# Altium schematic sheet PSoC6-Cardiac-Schematic.SchDoc
size 381 x 342 mm; SheetNumber: 1; SheetTotal: 1
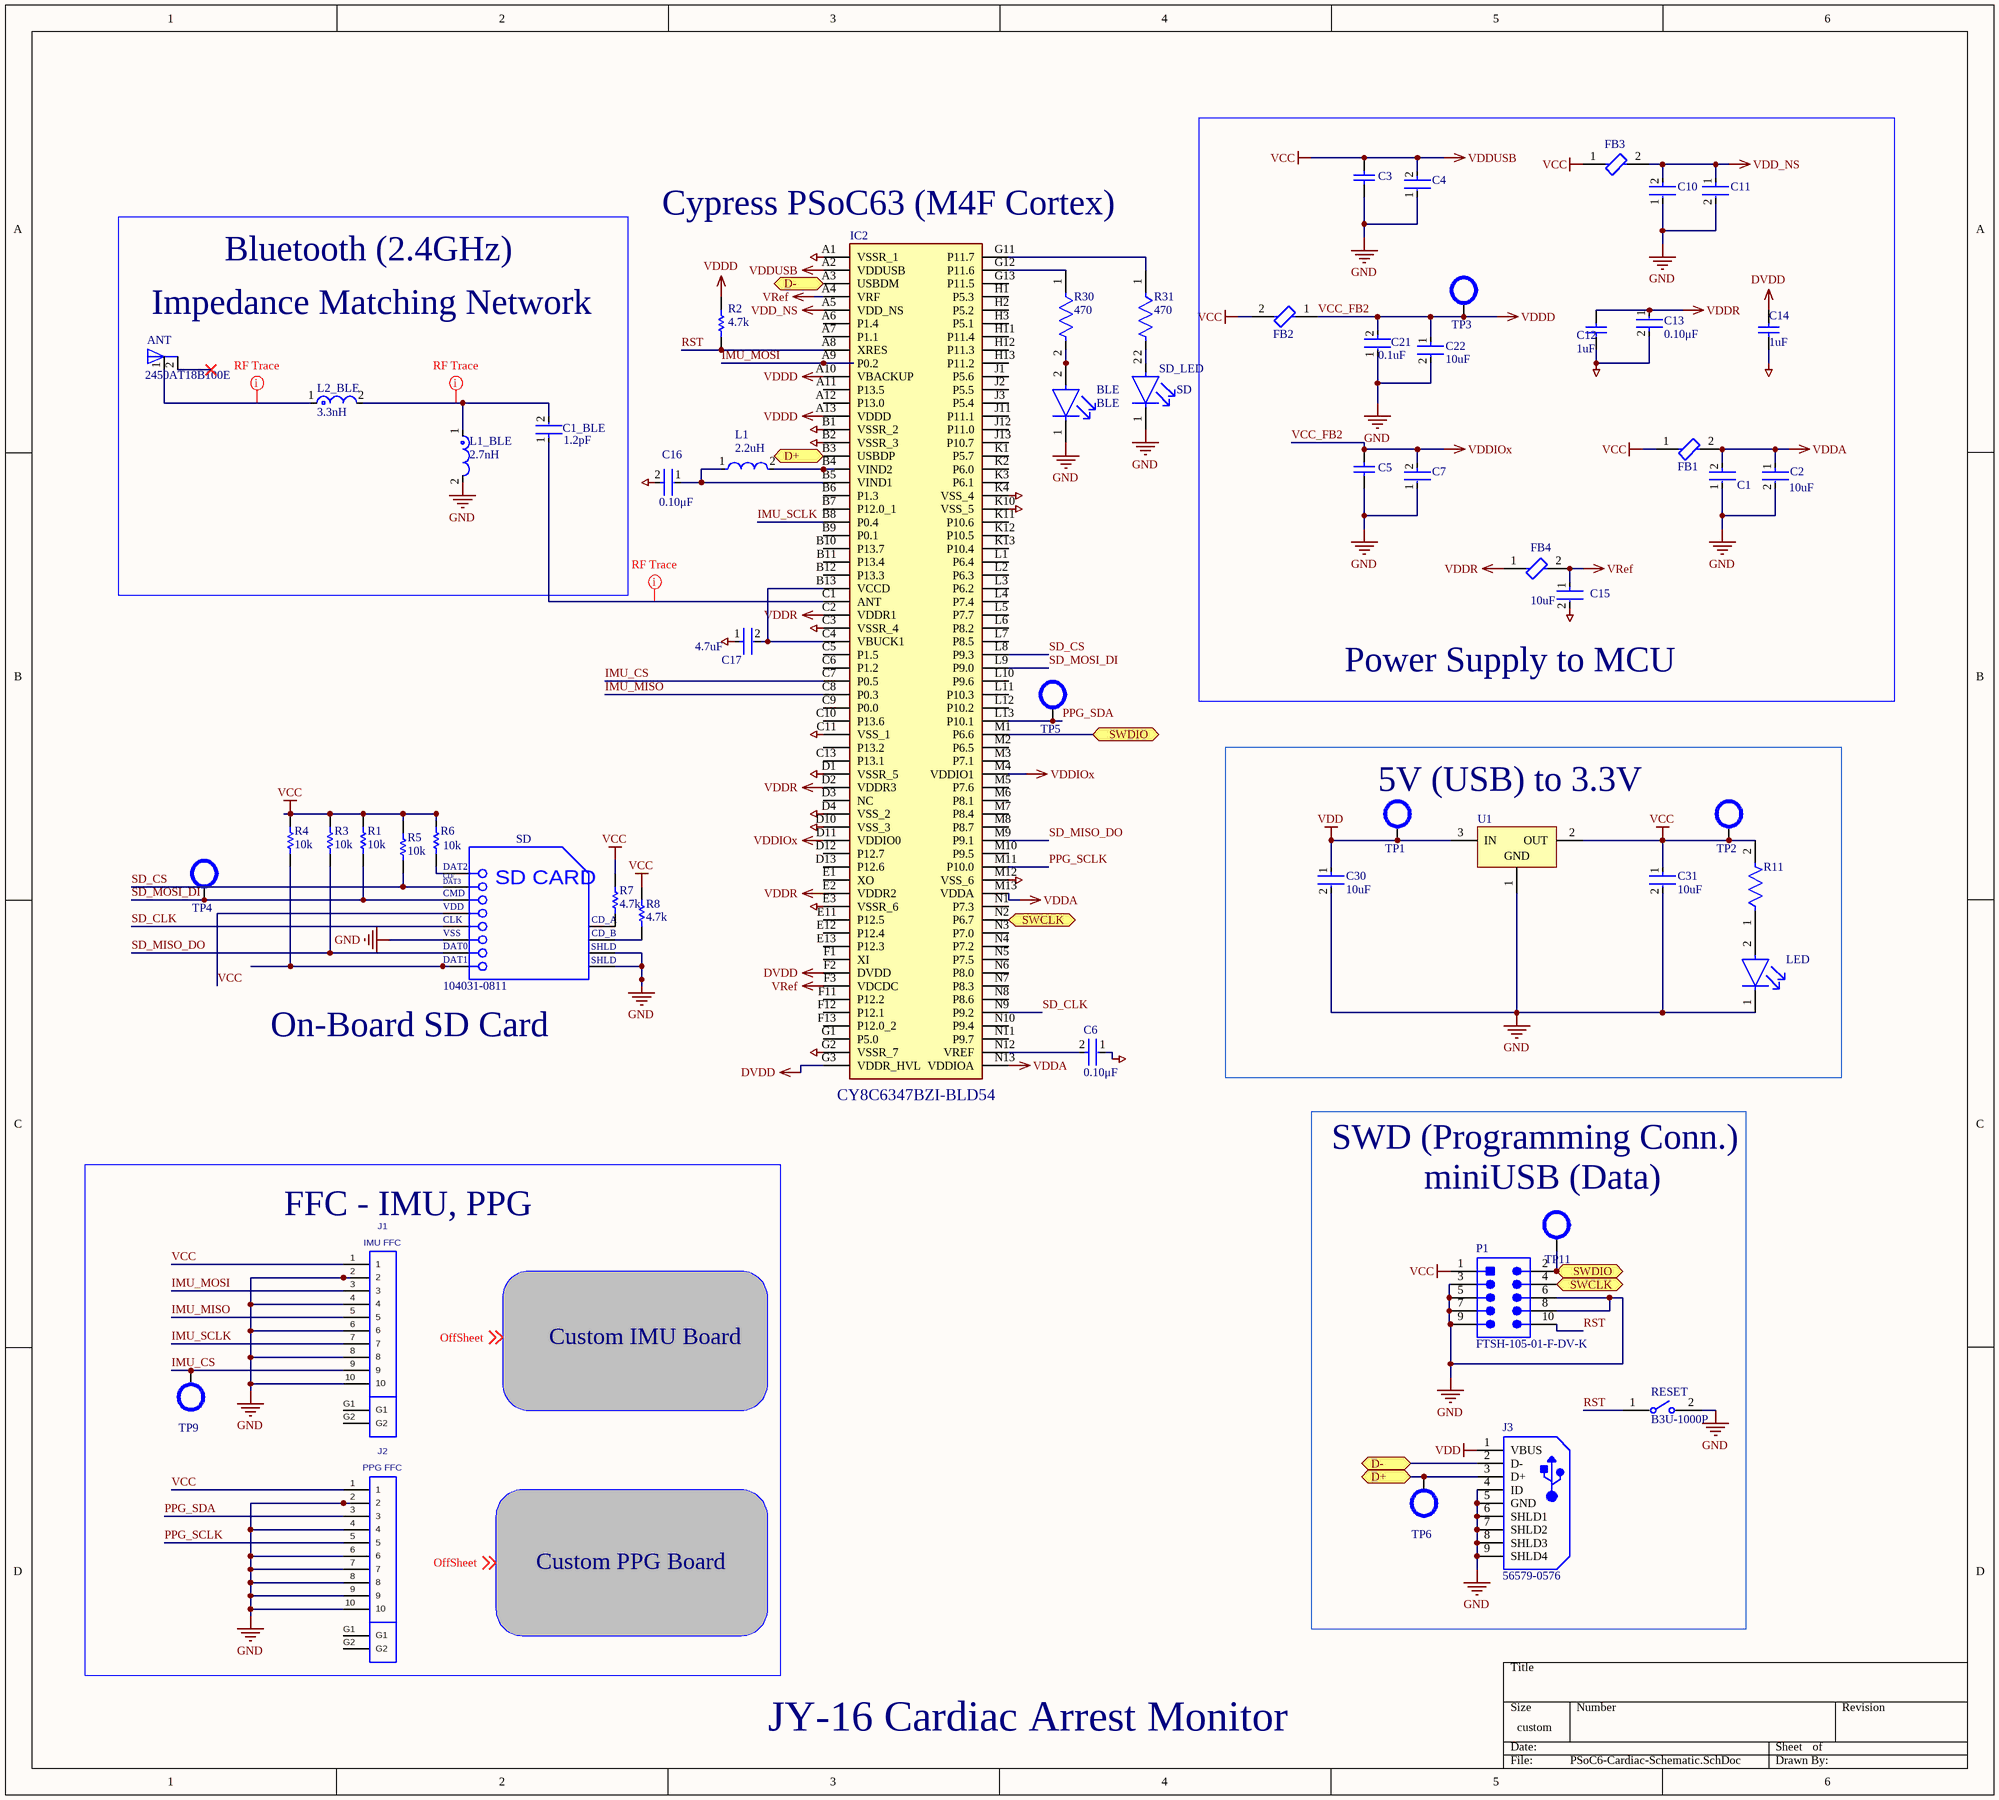
[diagram p0: PSoC6-Cardiac-Schematic.SchDoc]

## Parts
ANT  2450AT18B100E  [XDCR_2450AT18B100E]
BLE  BLE  [FP-6_541-5092_01-4-MFG]
C1  GRM155R71C104KA88D  [FP-GRM15-MFG]  (value not drawn)
C1_BLE  1.2pF  [FP-GJM155-0_05-IPC_B]
C2  10uF  [FP-GRM188-0_1-e0_2_0_55-IPC_A]
C3  GRM188R61E105KA12D  [CAPC1608X90X35LL10T15]  (value not drawn)
C4  GRM155R71C104KA88D  [FP-GRM15-MFG]  (value not drawn)
C5  GRM188R61E105KA12D  [CAPC1608X90X35LL10T15]  (value not drawn)
C6  Capacitance: 0.10μF  [FP-GRM15-MFG]  (hidden comment: GRM155R71C104KA88D)
C7  GRM155R71C104KA88D  [FP-GRM15-MFG]  (value not drawn)
C10  GRM155R71C104KA88D  [FP-GRM15-MFG]  (value not drawn)
C11  GRM188R60J106ME47D  [FP-GRM188-0_1-e0_2_0_55-IPC_A]  (value not drawn)
C12  value 1uF  [CAPC1608X90X35ML10T15]  (hidden comment: GRM188R61E105KA12D)
C13  Capacitance: 0.10μF  [FP-GRM15-MFG]  (hidden comment: GRM155R71C104KA88D)
C14  value 1uF  [CAPC1608X90X35ML10T15]  (hidden comment: GRM188R61E105KA12D)
C15  Capacitance: 10uF  [FP-GRM188-0_1-e0_2_0_55-IPC_A]  (hidden comment: GRM188R60J106ME47D)
C16  Capacitance: 0.10μF  [FP-GRM15-MFG]  (hidden comment: GRM155R71C104KA88D)
C17  Capacitance: 4.7uF  [FP-GRM155-0_1-IPC_B]  (hidden comment: GRM155R60J475ME47D)
C21  0.1uF  [FP-GRM15-MFG]
C22  10uF  [FP-GRM188-0_1-e0_2_0_55-IPC_A]
C30  10uF  [FP-GRM155-0_15-IPC_B]
C31  10uF  [FP-GRM155-0_15-IPC_B]
FB1  BLM18HE102SN1D  [FP-BLM18-0_15-t0_8-MFG]  (value not drawn)
FB2  BLM18HE102SN1D  [FP-BLM18-0_15-t0_8-MFG]  (value not drawn)
FB3  BLM18HE102SN1D  [FP-BLM18-0_15-t0_8-MFG]  (value not drawn)
FB4  BLM18HE102SN1D  [FP-BLM18-0_15-t0_8-MFG]  (value not drawn)
IC2  CY8C6347BZI-BLD54  [BGAS124C65P13X13_900X900X100]
J1  IMU FFC  [ZF5S-10-01-X-WT]
J2  PPG FFC  [ZF5S-10-01-X-WT]
J3  56579-0576  [MOLX-56579-0576_V]
L1  2.2uH  [FP-LQM21PH_G0-IPC_C]
L1_BLE  2.7nH  [FP-LQP03TG_02-IPC_A]
L2_BLE  3.3nH  [FP-LQG18HH_00-MFG]
LED  LTST-C190GKT  [FP-LTST-C190GKT-MFG]  (value not drawn)
P1  FTSH-105-01-F-DV-K  [SMTC-FTSH-105-01-L-DV-K_V]
R1  10k  [RESC1005X40X25LL05T10]
R2  4.7k  [RESC1005X40X25LL05T05]
R3  10k  [RESC1005X40X25LL05T10]
R4  10k  [RESC1005X40X25LL05T10]
R5  10k  [RESC1005X40X25LL05T10]
R6  10k  [RESC1005X40X25LL05T10]
R7  4.7k  [RESC1005X40X25LL05T05]
R8  4.7k  [RESC1005X40X25LL05T05]
R11  CRCW08052K00FKEA  [FP-CRCW0805-e3-IPC_B]  (value not drawn)
R30  470  [FP-CRCW0402-e3-MFG]
R31  470  [FP-CRCW0402-e3-MFG]
RESET  B3U-1000P  [FP-B3U-1000P-MFG]
SD  104031-0811  [MOLX-104031-0811_V]
SD_LED  SD  [FP-6_541-5092_01-4-MFG]
TP1  TestPoint  [TestPoint]  (value not drawn)
TP2  TestPoint  [TestPoint]  (value not drawn)
TP3  TestPoint  [TestPoint]  (value not drawn)
TP4  TestPoint  [TestPoint]  (value not drawn)
TP5  TestPoint  [TestPoint]  (value not drawn)
TP6  TestPoint  [TestPoint]  (value not drawn)
TP9  TestPoint  [TestPoint]  (value not drawn)
TP11  TestPoint  [TestPoint]  (value not drawn)
U1  ADP3338AKCZ-3.3-RL  [ADI-KC-3_L]  (value not drawn)

## Blocks framed on the sheet
Power Supply to MCU: C1-C5 C7 C10-C15 C21 C22 FB1-FB4 TP3
5V (USB) to 3.3V: C30 C31 LED R11 TP1 TP2 U1
FFC - IMU, PPG: J1 J2 TP9

## Ports
D+ (bidir), D- (bidir), SWCLK (bidir), SWDIO (bidir)

## Nets
DVDD: C14.1 IC2.F2(DVDD) IC2.G3(VDDR_HVL)
GND: BLE.1(C) C1.1 C2.2 C3.1 C4.1 C5.1 C6.1 C7.1 C10.1 C11.2 C12.2 C13.2 C14.2 C15.2 C16.2 C17.1 C21.1 C22.2 C30.2 C31.2 IC2.A1(VSSR_1) IC2.B1(VSSR_2) IC2.B2(VSSR_3) IC2.C3(VSSR_4) IC2.C11(VSS_1) IC2.D1(VSSR_5) IC2.D4(VSS_2) IC2.D10(VSS_3) IC2.E3(VSSR_6) IC2.G2(VSSR_7) IC2.K4(VSS_4) IC2.K10(VSS_5) IC2.M12(VSS_6) J1.2 J1.4 J1.6 J1.8 J1.10 J2.2 J2.4 J2.6 J2.7 J2.8 J2.9 J2.10 J3.4(ID) J3.5(GND) J3.6(SHLD1) J3.7(SHLD2) J3.8(SHLD3) J3.9(SHLD4) L1_BLE.2 LED.1(C) P1.3 P1.5 P1.6 P1.7 P1.8 P1.9 RESET.2 SD.6(VSS2) SD.11(SHLD1) SD.12(SHLD2) SD_LED.1(C) U1.1(GND)
VCC: C3.2 C4.2 C31.1 FB1.1 FB2.2 FB3.1 IC2.A2(VDDUSB) J1.1 J2.1 P1.1 R1.2 R3.2 R4.2 R5.2 R6.2 R7.2 R8.2 R11.2 SD.4(VDD) TP2.TP?(TP) U1.2(OUT)  [also labelled VDDUSB]
VCC_FB2: C5.2 C7.2 C21.2 C22.1 FB2.1 IC2.A10(VBACKUP) IC2.A13(VDDD) IC2.D11(VDDIO0) IC2.M4(VDDIO1) R2.2 TP3.TP?(TP)  [also labelled VDDD, VDDIOx]
VDD: C30.1 J3.1(VBUS) TP1.TP?(TP) U1.3(IN)
VDD_NS: C10.2 C11.1 FB3.2 IC2.A5(VDD_NS)
VDDA: C1.2 C2.1 FB1.2 IC2.M13(VDDA) IC2.N13(VDDIOA)
VDDR: C12.1 C13.1 FB4.1 IC2.C2(VDDR1) IC2.D2(VDDR3) IC2.E2(VDDR2)
VRef: C15.1 FB4.2 IC2.A4(VRF) IC2.F3(VDCDC)
D+: IC2.B3(USBDP) J3.3(D+) TP6.TP?(TP) ; port D+
D-: IC2.A3(USBDM) J3.2(D-) ; port D-
IMU_CS: IC2.C7(P0.5) J1.9 TP9.TP?(TP)
IMU_MISO: IC2.C8(P0.3) J1.5
IMU_MOSI: IC2.A9(P0.2) J1.3
IMU_SCLK: IC2.B8(P0.4) J1.7
PPG_SCLK: IC2.M11(P10.0) J2.5
PPG_SDA: IC2.L13(P10.1) J2.3 TP5.TP?(TP)
RST: IC2.A8(XRES) P1.10 R2.1 RESET.1
SD_CLK: IC2.N9(P9.2) SD.5(CLK)
SD_CS: IC2.L8(P9.3) R5.1 SD.2(CMD)
SD_MISO_DO: IC2.M9(P9.1) R3.1 SD.7(DAT0)
SD_MOSI_DI: IC2.L9(P9.0) R1.1 SD.3(VSS1) TP4.TP?(TP)
SWCLK: IC2.N2(P6.7) P1.4 ; port SWCLK
SWDIO: IC2.M1(P6.6) P1.2 TP11.TP?(TP) ; port SWDIO
NetANT_1: ANT.1(FEED) L2_BLE.1
NetBLE_2: BLE.2(A) R30.2
NetC1_BLE_1: C1_BLE.1 IC2.C1(ANT)
NetC1_BLE_2: C1_BLE.2 L1_BLE.1 L2_BLE.2
NetC6_2: C6.2 IC2.N12(VREF)
NetC16_1: C16.1 IC2.B5(VIND1) L1.1
NetC17_2: C17.2 IC2.B13(VCCD) IC2.C4(VBUCK1)
NetIC2_B4: IC2.B4(VIND2) L1.2
NetIC2_G11: IC2.G11(P11.7) R31.1
NetIC2_G12: IC2.G12(P11.6) R30.1
NetLED_2: LED.2(A) R11.1
NetR4_1: R4.1 SD.8(DAT1)
NetR6_1: R6.1 SD.1(CD/DAT3)
NetR7_1: R7.1 SD.9(CD_A)
NetR8_1: R8.1 SD.10(CD_B)
NetR31_2: R31.2 SD_LED.2(A)

Not connected (* = marked no-connect by the designer): ANT 2(NC)*; IC2 ?1(P13.2) A6(P1.4) A7(P1.1) A11(P13.5) A12(P13.0) B6(P1.3) B7(P12.0_1) B9(P0.1) B10(P13.7) B11(P13.4) B12(P13.3) C5(P1.5) C6(P1.2) C9(P0.0) C10(P13.6) C13(P13.1) D3(NC) D12(P12.7) D13(P12.6) E1(XO) E11(P12.5) E12(P12.4) E13(P12.3) F1(XI) F11(P12.2) F12(P12.1) F13(P12.0_2) G1(P5.0) G13(P11.5) H1(P5.3) H2(P5.2) H3(P5.1) H11(P11.4) H12(P11.3) H13(P11.2) J1(P5.6) J2(P5.5) J3(P5.4) J11(P11.1) J12(P11.0) J13(P10.7) K1(P5.7) K2(P6.0) K3(P6.1) K11(P10.6) K12(P10.5) K13(P10.4) L1(P6.4) L2(P6.3) L3(P6.2) L4(P7.4) L5(P7.7) L6(P8.2) L7(P8.5) L10(P9.6) L11(P10.3) L12(P10.2) M2(P6.5) M3(P7.1) M5(P7.6) M6(P8.1) M7(P8.4) M8(P8.7) M10(P9.5) N1(P7.3) N3(P7.0) N4(P7.2) N5(P7.5) N6(P8.0) N7(P8.3) N8(P8.6) N10(P9.4) N11(P9.7); J1 G1 G2; J2 G1 G2

## Layout directives
mark named RF Trace: NetANT_1, NetC1_BLE_1, NetC1_BLE_2

## Notes on the sheet
- (near IC2) Cypress PSoC63 (M4F Cortex)
- Bluetooth (2.4GHz)
- (near ANT) Impedance Matching Network
- (near SD) On-Board SD Card
- SWD (Programming Conn.)
- (near TP11) miniUSB (Data)
- Custom IMU Board
- Custom PPG Board
- JY-16 Cardiac Arrest Monitor
- Labels drawn without touching a wire or pin: OffSheet
- (in symbol CMP-2000-05825-1) DAT2; CD/; DAT3; SD CARD; VSS; SHLD

## Library data of the parts
ANT = 2450AT18B100E: 2.4GHz - Chip RF Antenna 2.4GHz ~ 2.5GHz 0.5dBi Solder Surface Mount; MF: Johanson Technology; Price: None; Package: None; Purchase-URL: https://pricing.snapeda.com/search/part/2450AT18B100E/?ref=eda; MP: 2450AT18B100E; Availability: In Stock; SnapEDA_Link: https://www.snapeda.com/parts/2450AT18B100E/Johanson+Technology+Inc./view-part/?ref=snap; Check_prices: https://www.snapeda.com/parts/2450AT18B100E/Johanson+Technology+Inc./view-part/?ref=eda; Value: *
BLE = CMP-02520-000011-1: LED GREEN 0603 SMD; Manufacturer Part Number: VLMG1300-GS08; Manufacturer: Vishay; Peak Emmision Wavelength: 574nm; Power Dissipation: 75mW; Viewing Angle: 130°; Reverse Voltage: 5V; Led Orientation: Top View; Forward Current: 20mA; Forward Voltage: 2V; Luminous Intensity: 35mcd; Wavelength: 571nm; Height: 1mm; Mouser Description: LED; SMD; 0603; yellow green; 18-35mcd; 1.6x0.8x0.8mm; 130°; 2÷2.4V; Category: Diode; Temperature: -35°C to +85°C; Ambient Temperature Range Low: -35°C; Package: 6.541-5092.01-4; Colour: Yellow Green; RoHS: TRUE; Device Class L2: LEDs; ComponentLink2Description: Datasheet; Device Class L3: unset; Octopart: https://octopart.com/vlmg1300-gs08-vishay-21709199; Device Class L1: Optoelectronics; Temperature Range Low: -35°C; Automotive: No; Lead Free: Yes; Ambient Temperature Range High: +85°C; Digikey Description: LED GREEN 0603 SMD; Temperature Range High: +85°C; ComponentLink2URL: http://www.vishay.com/docs/82437/vlmo1300.pdf
C1 C4 C7 C10 = CMP-2100-03641-2: CAP CER 0.1UF 16V X7R 0402; Manufacturer: Murata; Standoff Height: 0mm; Tolerance: 10%; Voltage Rating: 16Vdc; Material: Ceramic; Capacitance: 0.10μF; Value: 0.10μF; RoHS: TRUE; Manufacturer Part Number: GRM155R71C104KA88D; Temperature Characteristic: X7R; Octopart: https://octopart.com/grm155r71c104ka88d-murata-196880; Digikey Description: CAP CER 0.1UF 16V X7R 0402; Device Class L3: Ceramic Capacitors; Height: 0.55mm; ComponentLink2Description: Datasheet; Temperature Range Low: -55°C; Ipc Land Pattern Name: CAPC10050X219; ComponentLink2URL: https://search.murata.co.jp/Ceramy/image/img/A01X/G101/ENG/GRM155R71H471KA01-01A.pdf; Device Class L1: Passive Components; Lead Free: yes; Category: Cap; Package: GRM15; Temperature: -55°C to +125°C; Device Class L2: Capacitors; Temperature Range High: +125°C; Mouser Description: 0402 0.1 uF 16V ±10 % Tolerance X7R SMT Multilayer Ceramic Capacitor
C1_BLE = CMP-2008-03813-2: Multi-Layer Ceramic Capacitor 1.2pF C0G  ±0.1pF 0402 Paper T/R; Voltage Rating (DC): 50V; Temperature Coefficient: 30ppm/°C; Case Code (Metric): 1005; Lead Free: Lead Free; Packaging: Tape and Reel; Radiation Hardening: No; Dielectric: C0G; Case Code (Imperial): 0402; Weight: 2.3E-05oz; Width: 0.5mm; Case/Package: 0402; Length: 1mm; Voltage Rating: 50V; Number of Pins: 2; Depth: 0.5mm; Thickness: 0.022inch; Voltage: 50V; Package Quantity: 10000; Max Operating Temperature: 125°C; Height: 0.5mm; REACH SVHC: No SVHC; Capacitance: 1.2pF; Mount: Surface Mount; Min Operating Temperature: -55°C; Termination: SMD/SMT; Lead Pitch: 0.3mm
C2 C11 C15 C22 = CMP-2006-02792-2: Chip Multilayer Ceramic Capacitors for General Purpose, 0603, 10uF, X5R, 15%, 20%, 6.3V; Tolerance: 20%; Height: 0.8mm; Lead Free: Lead Free; Material: Ceramic; Voltage: 6.3V; Voltage Rating: 6.3V; Packaging: Tape and Reel; Voltage Rating (DC): 6.3V; Width: 0.031inch; Termination: SMD/SMT; Dielectric: X5R; Package Quantity: 4000; Case/Package: 0603; Min Operating Temperature: -55°C; Length: 1.6mm; Thickness: 0.035inch; Depth: 0.8mm; Case Code (Imperial): 0603; Max Operating Temperature: 85°C; Mount: Surface Mount; REACH SVHC: No SVHC; Radiation Hardening: No; Case Code (Metric): 1608
  C2 C11 C22: Capacitance: 10uF
C3 C5 C12 C14 = CMP-2006-02459-1: Manufacturer: Murata; Part Number: GRM188R61E105KA12D
C6 C13 C16 = CMP-2100-03641-2: CAP CER 0.1UF 16V X7R 0402; Manufacturer: Murata; Standoff Height: 0mm; Tolerance: 10%; Voltage Rating: 16Vdc; Material: Ceramic; Value: 0.10μF; RoHS: TRUE; Manufacturer Part Number: GRM155R71C104KA88D; Temperature Characteristic: X7R; Octopart: https://octopart.com/grm155r71c104ka88d-murata-196880; Digikey Description: CAP CER 0.1UF 16V X7R 0402; Device Class L3: Ceramic Capacitors; Height: 0.55mm; ComponentLink2Description: Datasheet; Temperature Range Low: -55°C; Ipc Land Pattern Name: CAPC10050X219; ComponentLink2URL: https://search.murata.co.jp/Ceramy/image/img/A01X/G101/ENG/GRM155R71H471KA01-01A.pdf; Device Class L1: Passive Components; Lead Free: yes; Category: Cap; Package: GRM15; Temperature: -55°C to +125°C; Device Class L2: Capacitors; Temperature Range High: +125°C; Mouser Description: 0402 0.1 uF 16V ±10 % Tolerance X7R SMT Multilayer Ceramic Capacitor
C17 = CMP-2008-04549-2: Chip Multilayer Ceramic Capacitors for General Purpose, 0402, 4.7uF, X5R, 15%, 20%, 6.3V; Height: 0.5mm; Weight: 0.000212oz; Length: 1mm; Case Code (Metric): 1005; Packaging: Tape and Reel; Termination: SMD/SMT; Dielectric: X5R; Depth: 0.5mm; Case Code (Imperial): 0402; Min Operating Temperature: -55°C; Case/Package: 0402; Voltage: 6.3V; Width: 0.02inch; Lead Free: Lead Free; Thickness: 0.022inch; Contact Plating: Tin; REACH SVHC: No SVHC; Package Quantity: 10000; Tolerance: 20%; Voltage Rating (DC): 6.3V; Voltage Rating: 6.3V; Mount: Surface Mount; Max Operating Temperature: 85°C
C21 = CMP-2100-03641-2: CAP CER 0.1UF 16V X7R 0402; Manufacturer Part Number: GRM155R71C104KA88D; Manufacturer: Murata; Standoff Height: 0mm; Tolerance: 10%; Voltage Rating: 16Vdc; Material: Ceramic; Capacitance: 0.10μF; Value: 0.10μF; RoHS: TRUE; Temperature Characteristic: X7R; Octopart: https://octopart.com/grm155r71c104ka88d-murata-196880; Digikey Description: CAP CER 0.1UF 16V X7R 0402; Device Class L3: Ceramic Capacitors; Height: 0.55mm; ComponentLink2Description: Datasheet; Temperature Range Low: -55°C; Ipc Land Pattern Name: CAPC10050X219; ComponentLink2URL: https://search.murata.co.jp/Ceramy/image/img/A01X/G101/ENG/GRM155R71H471KA01-01A.pdf; Device Class L1: Passive Components; Lead Free: yes; Category: Cap; Package: GRM15; Temperature: -55°C to +125°C; Device Class L2: Capacitors; Temperature Range High: +125°C; Mouser Description: 0402 0.1 uF 16V ±10 % Tolerance X7R SMT Multilayer Ceramic Capacitor
C30 C31 = CMP-06035-012416-1: GRM155R60J106ME15D / Chip Multilayer Ceramic Capacitors for General Purpose, 0402, 10uF, X5R, 15%, 20%, 6.3V; Thickness: 0.026inch; Case Code (Imperial): 0402; Tolerance: 20%; Min Operating Temperature: -55°C; Length: 0.039inch; Packaging: Tape and Reel; Max Operating Temperature: 85°C; Case Code (Metric): 1005; Mount: Surface Mount; Dielectric: X5R; Capacitance: 10uF; Case/Package: 0402; Voltage Rating: 6.3V; Voltage Rating (DC): 6.3V; Width: 0.02inch
FB1-FB4 = CMP-0686-00363-3: Chip Ferrite Bead, 0603, 1000Ω @ 100MHz, 0.35Ω, 25%, 600mA; DC Resistance (DCR): 350mR; Impedance: 1kR; Number of Circuits: 1; Material: Steel; Packaging: Tape and Reel; Test Frequency: 100MHz; Max Operating Temperature: 125°C; Core Material: Ferrite; Width: 0.8mm; Height: 0.8mm; Case/Package: 0603; Termination: SMD/SMT; Length: 1.6mm; Radiation Hardening: No; REACH SVHC: No SVHC; Max DC Current: 600mA; Case Code (Imperial): 0603; Min Operating Temperature: -55°C; DC Current: 600mA; Current Rating: 600mA; Lead Free: Lead Free; Number of Lines: 1; Tolerance: 25%; Max Current Rating: 600mA; Case Code (Metric): 1608; Package Quantity: 1; Depth: 0.8mm; Military Standard: Not; Number of Pins: 2
IC2 = CY8C6347BZI-BLD54: Integrated Circuit; Manufacturer_Name: Cypress Semiconductor; Datasheet Link: https://www.arrow.com/en/products/cy8c6347bzi-bld54/cypress-semiconductor; Height: 1mm; Manufacturer_Part_Number: CY8C6347BZI-BLD54; Mouser Part Number: 727-CY8C6347BZIBLD54; Mouser Price/Stock: https://www.mouser.co.uk/ProductDetail/Cypress-Semiconductor/CY8C6347BZI-BLD54/?qs=XeJtXLiO41TbiRPpjrRqiA%3D%3D; Arrow Part Number: CY8C6347BZI-BLD54; Arrow Price/Stock: https://www.arrow.com/en/products/cy8c6347bzi-bld54/cypress-semiconductor
J1 J2 = ZF5S-10-01-X-WT: ZERO INSERTION FORCE 0.5MM ASSEMBLY, 01 LEAD STYLE.; MANUFACTURER: SAMTEC; CREATED: January 30, 2015 - Wendy Xin; PCB DECAL: ZF5S-10-01-X-WT
J3 = CMP-2000-05643-1: USB Connector, 30 V, 1 A, 0 to 50 degC, 5-Pin SMD, RoHS, Tape and Reel; Brand: Molex; Insulation Resistance: 100MOhms; Connector Type: MiniUSBTypeABReceptacle; Mounting Angle: Right; Number of Ports: 1Port; Gender: Female; Voltage Rating: 30VAC/DC; Number of Contacts: 5Contact; Current Rating: 1A; Package Reference: 56579-0576; Package Description: 5-Pin Surface Mount Device, Body 9.9 x 9 mm, Pitch 0.8 mm; Color: Gray; Manufacturer URL: http://www.molex.com/; Product: MiniUSBTypeABConnectors; Factory Pack Quantity: 800; Standard: USB; Termination Style: SolderTab; Contact Plating: Gold; Product Category: USBConnectors; Datasheet Version: Rev. E, 04/2006; Operating Temperature Range: 0Cto+50C; RoHS: Details; Manufacturer: Molex; Features: MetalshieldingforESDprotection; Mounting Technology: SurfaceMount; Flammability Rating: UL94V-0; Datasheet URL: http://www.molex.com/pdm_docs/sd/565790576_sd.pdf; Series: 56579; Contact Material: CopperAlloy; Packaging: Reel
L1 = CMP-06042-016317-1: Multilayer Type Inductor for Power Lines, 0805 (2012), 2.2μH, 30%, 0.288Ω, 0.8A; Test Frequency: 1MHz; Shielding: Shielded; Current Rating: 800mA; Self Resonant Frequency: 40MHz; Core Material: Ferrite; DC Resistance (DCR): 288mR; RoHS Compliant: Yes; REACH SVHC: No SVHC; Inductance Tolerance: 30%; Package Quantity: 4000; Military Standard: Not; Max Operating Temperature: 125°C; Radiation Hardening: No; Series: LQM; Height - Seated (Max): 0.039inch; Tolerance: 30%; Height: 0.9mm; Lead Free: Lead Free; Case Code (Metric): 2012; Packaging: Tape and Reel; Termination: SMD/SMT; Case Code (Imperial): 0805; Min Operating Temperature: -55°C; Depth: 1.4mm; Mount: Surface Mount; Length: 2mm; Inductance: 2.2uH; DC Current: 800mA; Case/Package: 0805; Max DC Current: 800mA; Width: 0.049inch
L1_BLE = CMP-06042-013213-1: Film type RF Inductor 2.7nH ±0.1nH 500mA 0.2Ω 0201 (0603); Core Material: Non-Magnetic; Tolerance: 3%; Self Resonant Frequency: 6GHz; Current: 350mA; Test Frequency: 500MHz; Q Factor: 14; DC Resistance (DCR): 200mR; Shielding: Unshielded; DC Current: 500mA; Resistor Type: Thin Film; Case/Package: 0201; Max DC Current: 500mA; Length: 0.024inch; Case Code (Imperial): 0201; Min Operating Temperature: -55°C; Width: 0.3mm; Termination: SMD/SMT; Inductance: 2.7nH; REACH SVHC: No SVHC; Max Operating Temperature: 125°C; Height: 0.3mm; Height - Seated (Max): 0.013inch; Military Standard: Not; Packaging: Tape and Reel; Radiation Hardening: No; Lead Free: Lead Free; Package Quantity: 15000; Case Code (Metric): 0603; Current Rating: 500mA; Mount: Surface Mount; Depth: 0.33mm
L2_BLE = CMP-06042-009861-1: Multilayer type RF Inductor 3.3nH ±0.3nH 0.12Ω 1000mA 0603; Max DC Current: 500mA; Q Factor: 12; DC Resistance (DCR): 150mR; Test Frequency: 100MHz; Self Resonant Frequency: 6GHz; Shielding: Unshielded; Core Material: Air; Case/Package: 0603; DC Current: 500mA; Case Code (Metric): 1608; Package Quantity: 4000; Depth: 0.95mm; Max Operating Temperature: 85°C; Height - Seated (Max): 0.037inch; Mount: Surface Mount; REACH SVHC: No SVHC; Length: 1.6mm; Min Operating Temperature: -55°C; Military Standard: Not; Lead Free: Lead Free; Width: 0.8mm; Packaging: Tape and Reel; Height: 0.8mm; Termination: SMD/SMT; Current Rating: 500mA; Case Code (Imperial): 0603; Inductance: 3.3nH; Radiation Hardening: No
LED = CMP-22017-000005-2: LED GREEN CLEAR CHIP SMD; Dominant Wavelength: 569nm; Reverse Voltage: 5V; Lens Color: Colorless; Viewing Angle: 130°; Voltage: 2V; Forward Current: 30mA; Power Dissipation: 100mW; Luminous Intensity: 6mcd; Number of LEDs: 1; Forward Voltage: 2.1V; Wavelength: 565nm; Test Current: 10mA; Min Operating Temperature: -55°C; Lens Style: Clear; Mount: Surface Mount; Width: 0.8mm; Packaging: Tape and Reel; Lens Transparency: Clear; Case Code (Metric): 1608; Depth: 0.8mm; Case Code (Imperial): 0603; Case/Package: 0603; Number of Pins: 2; Max Operating Temperature: 85°C; Lead Free: Lead Free; Number of Elements: 1; Length: 1.6mm; Height: 0.8mm; Package Quantity: 1; Power Rating: 100mW; Radiation Hardening: No; Illumination Color: Green; Color: Green
P1 = CMP-2000-05352-1: Male Header, Pitch 1.27 mm, 2 x 5 Position, Height 6.12 mm, RoHS, Tube; Manufacturer: Samtec; Number of Positions: 10; Connector Type: Header,Shrouded; Number of Positions Loaded: All; Row Spacing: 0.050"(1.27mm); Fastening Type: -; Package Reference: FTSH-105-01-L-DV-K; Termination: Solder; Package URL: http://suddendocs.samtec.com/prints/ftsh-1xx-xx-xxx-dv-xxx-footprint.pdf; Number of Rows: 2; Contact Finish Thickness: 3µin(0.08µm); Contact Type: MalePin; Manufacturer URL: http://www.samtec.com/; Contact Mating Length: 0.120"(3.05mm); Pitch: 0.050"(1.27mm); Series: FTSH; Features: -; Contact Finish: Gold; Color: Black; Family: RectangularConnectors-Headers,MalePins; Datasheet URL: http://suddendocs.samtec.com/prints/ftsh-1xx-xx-xxx-dv-xxx-mkt.pdf; Package Description: Male Header, Pitch 1.27 mm, 2 x 5 Position, Height 5.97 mm, Tail Length 4.32 mm; Mounting Type: SurfaceMount; Datasheet Version: Rev. ET, 10/1995; Category: Connectors,Interconnects; Packaging: Tube
R1 R3-R6 = CMP-2002-07353-1: Part Number: RC0402FR-0710KL; Manufacturer: Yageo / Phycomp
R2 R7 R8 = CMP-2002-01154-4: Chip Resistor, 4.7 KOhm, +/- 1%, 0.1 W, -55 to 155 degC, 0402 (1005 Metric), RoHS, Tape and Reel; PartNumber: ERJ-2RKF4701X; Voltage Rating: 50 V; Case\/Package: 0402; Power Rating: 100 mW; Height: 0.35 mm; Mounting Technology: Surface Mount; REACH SVHC: Yes; Resistance: 4.7 KOhm; Max Operating Temperature: 155 degC; ComponentLink1Description: Manufacturer URL; ComponentLink2Description: Datasheet; Pins: 2; PackageReference: 0402; Tolerance: 1%; Case Code (Imperial): 0402; Length: 1 mm; PackageDescription: 2-Pin Surface Mount Device, Body 1 x 0.5 mm; RoHSCompliant: true; Package Quantity: 1; Radiation Hardening: No; DatasheetVersion: 04/2015; Width: 0.5 mm; Case Code (Metric): 1005; Mount: Surface Mount; ComponentLink1URL: http://www.panasonic.com/; Min Operating Temperature: -55 degC; Packaging: Cut Tape; ComponentLink2URL: http://industrial.panasonic.com/cdbs/www-data/pdf/RDA0000/AOA0000C86.pdf
R11 = CMP-2001-03755-2: RES Thick Film, 2kΩ, 1%, 0.125W, 100ppm/°C, 0805; Working Voltage: 150V; Max Power Dissipation: 125mW; Resistance: 2kR; Package Quantity: 10; Case Code (Metric): 2012; Voltage Rating: 150V; Number of Terminations: 2; Max Operating Temperature: 155°C; Depth: 1.25mm; Tolerance: 1%; Power Rating: 125mW; Lead Free: Lead Free; Case/Package: 0805; Features: Automotive AEC-Q200; Min Operating Temperature: -55°C; Termination: SMD/SMT; Case Code (Imperial): 0805; Weight: 0.000194oz; Packaging: Tape and Reel; Military Standard: Not; Radiation Hardening: No; Contact Plating: Tin; Mount: Surface Mount; Temperature Coefficient: 100ppm/°C; Height: 0.02inch; Number of Terminals: 2; Voltage Rating (DC): 150V; Number of Pins: 2; Length: 2mm; Width: 1.25mm; Composition: Thick Film
R30 R31 = CMP-2002-00022-2: RES Thick Film, 470Ω, 1%, 0.063W, 100ppm/°C, 0402; Power Rating: 63mW; Voltage Rating (DC): 50V; Resistance: 470R; Case Code (Imperial): 0402; Tolerance: 1%; Lead Free: Lead Free; Max Operating Temperature: 155°C; Military Standard: Not; Height: 0.35mm; Termination: SMD/SMT; Mount: Surface Mount; Features: Automotive AEC-Q200; Composition: Thick Film; Temperature Coefficient: 100ppm/°C; Case Code (Metric): 1005; Package Quantity: 10; Radiation Hardening: No; Max Power Dissipation: 63mW; Weight: 2.3E-05oz; Width: 0.5mm; Length: 1mm; Depth: 0.5mm; Min Operating Temperature: -55°C; Voltage Rating: 50V; Case/Package: 0402; Packaging: Tape and Reel; Contact Plating: Tin; Number of Terminations: 2
RESET = CMP-2100-03586-2: SWITCH TACTILE SPST-NO 0.05A 12V; Contact Resistance: 100mR; Operating Force: 1.5N; Max Current Rating: 50mA; Switch Travel: 0.15mm; Actuator Type: Standard; Mechanical Life: 200000Cycles; Ratings: Dust Proof; Illumination Type: Non-Illuminated; Throw Configuration: SPST; Actuator Length: 0.4mm; Switch Function: Off-Mom; Height: 1.2mm; Width: 3mm; Weight: 0.000776oz; Contact Material: Silver; Max Voltage Rating (DC): 12V; Insulation Resistance: 100MR; Lead Free: Lead Free; Current Rating: 50mA; Termination: SMD/SMT; Length: 4mm; Voltage Rating (DC): 12V; Contact Current Rating: 50mA; Orientation: Straight; Depth: 2.5mm; Max Operating Temperature: 70°C; Packaging: Tape and Reel; Min Operating Temperature: -25°C; Package Quantity: 1; Mount: Surface Mount; Electrical Life: 200000Cycles
SD = CMP-2000-05825-1: Micro SD Card, RA, -25 to 85 degC, 8-Pin SMD, RoHS, Tape and Reel; Voltage Rating: 10VAC/DC; Number of Contacts: 8; Insertion - Extraction Style: Push-Pull; Pitch: 1.1mm; Mating Cycles: 10000; Brand: Molex; Current Rating: 500mA; Manufacturer URL: http://www.molex.com/; Card Type: microSD; Mounting Type: Standard; Height: 1.42mm; Mounting Technology: SurfaceMount; Contact Plating: Gold; Product Category: MemoryCardConnectors; Package Description: 8-Pin Surface Mount Device, Body 11.95 x 11.4 mm, Pitch 1.1 mm; Datasheet URL: http://www.molex.com/pdm_docs/sd/1040310811_sd.pdf; Termination Style: SMD; Length: 11.4mm; Housing Material: LiquidCrystalPolymer(LCP); Orientation: RightAngle; RoHS: True; Contact Material: PhosphorBronze; Datasheet Version: Rev. E, 04/2006; Packaging: Reel; Manufacturer: Molex; Series: 104031; Product: CardConnectors; Number of Rows: 1Row; Package Reference: 104031-0811
SD_LED = CMP-02520-000012-1: LED RED 0603 SMD; Manufacturer: Vishay; Manufacturer Part Number: VLMS1300-GS08; Forward Voltage: 2V; Reverse Voltage: 5V; Power Dissipation: 75mW; Forward Current: 20mA; Luminous Intensity: 54mcd; Led Orientation: Top View; Peak Emmision Wavelength: 639nm; Viewing Angle: 130°; Wavelength: 631nm; Digikey Description: LED RED 0603 SMD; Height: 1mm; Colour: Red; Ambient Temperature Range High: +85°C; Ambient Temperature Range Low: -35°C; Package: 6.541-5092.01-4; Automotive: No; Temperature Range High: +85°C; Device Class L3: unset; Lead Free: Yes; Temperature Range Low: -35°C; Temperature: -35°C to +85°C; Device Class L2: LEDs; ComponentLink2Description: Datasheet; Octopart: https://octopart.com/vlms1300-gs08-vishay-21709201; Device Class L1: Optoelectronics; RoHS: TRUE; ComponentLink2URL: http://www.vishay.com/docs/82437/vlmo1300.pdf; Mouser Description: Standard LEDs - SMD Super Red Clear Non-Diff; Category: Diode
U1 = CMP-0786-00152-1: High Accuracy, Ultralow IQ, 1 A, anyCAP(R) Low Dropout Regulator, 2.7 to 8 V Vin, 3.3 V Vout, Industrial, 3-pin SOT223 (KC-3), Reel; Manufacturer: Analog Devices; Supply Current IGND @ Small Load: 110uA; Iout max: 1A; Preset Vout Values (V): 3.3; Vin (max) (V): 8; Vin (min) (V): 2.7; ComponentLink1URL: http://www.analog.com/en/index.html; ComponentLink4URL: Product URL:http://www.analog.com/en/ADP3338/productSearch.html; ComponentLink3Description: Package Specification; ComponentLink4Description: URL Link1; PackageDescription: 3-Pin Small Outline Transistor Package, Body 3.5 x 6.5 mm, Pitch 2.3 mm; DatasheetVersion: Rev. B; PackageReference: KC-3; PackageVersion: 11-20-2012-B, 11/2012; PartNumber: ADP3338AKCZ-3.3-RL; ComponentLink3URL: http:/www.analog.com/static/imported-files/packages/PKG_PDF/SOT_223(KC)/KC_3.pdf; ComponentLink2Description: Datasheet; ComponentLink2URL: http://www.analog.com/static/imported-files/data_sheets/ADP3338.pdf; Packing: Reel; Mounting Technology: Surface Mount; Code_JEDEC: TO-261-AA; ComponentLink1Description: Manufacturer URL